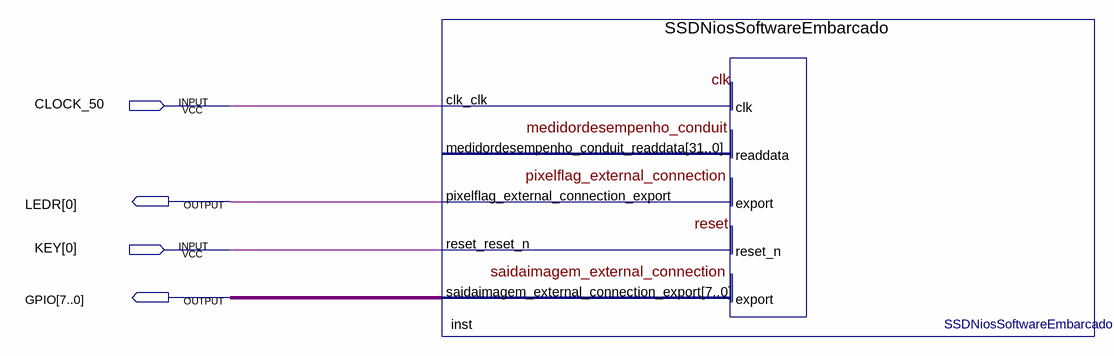
[diagram p0: schematic sheet]
// Quartus schematic SSDNiosSoftware.bdf as structural Verilog: 1 symbols, 4 pins
module SSDNiosSoftware (
  input  CLOCK_50,
  input  [0:0] KEY,
  output [0:0] LEDR,
  output [7:0] GPIO
);

  SSDNiosSoftwareEmbarcado inst (
    .clk_clk(CLOCK_50), .reset_reset_n(KEY[0]), .pixelflag_external_connection_export(LEDR[0]),
    .saidaimagem_external_connection_export(GPIO));  // open: medidordesempenho_conduit_readdata
endmodule
